# Altium project PCB_Project.PrjPcb
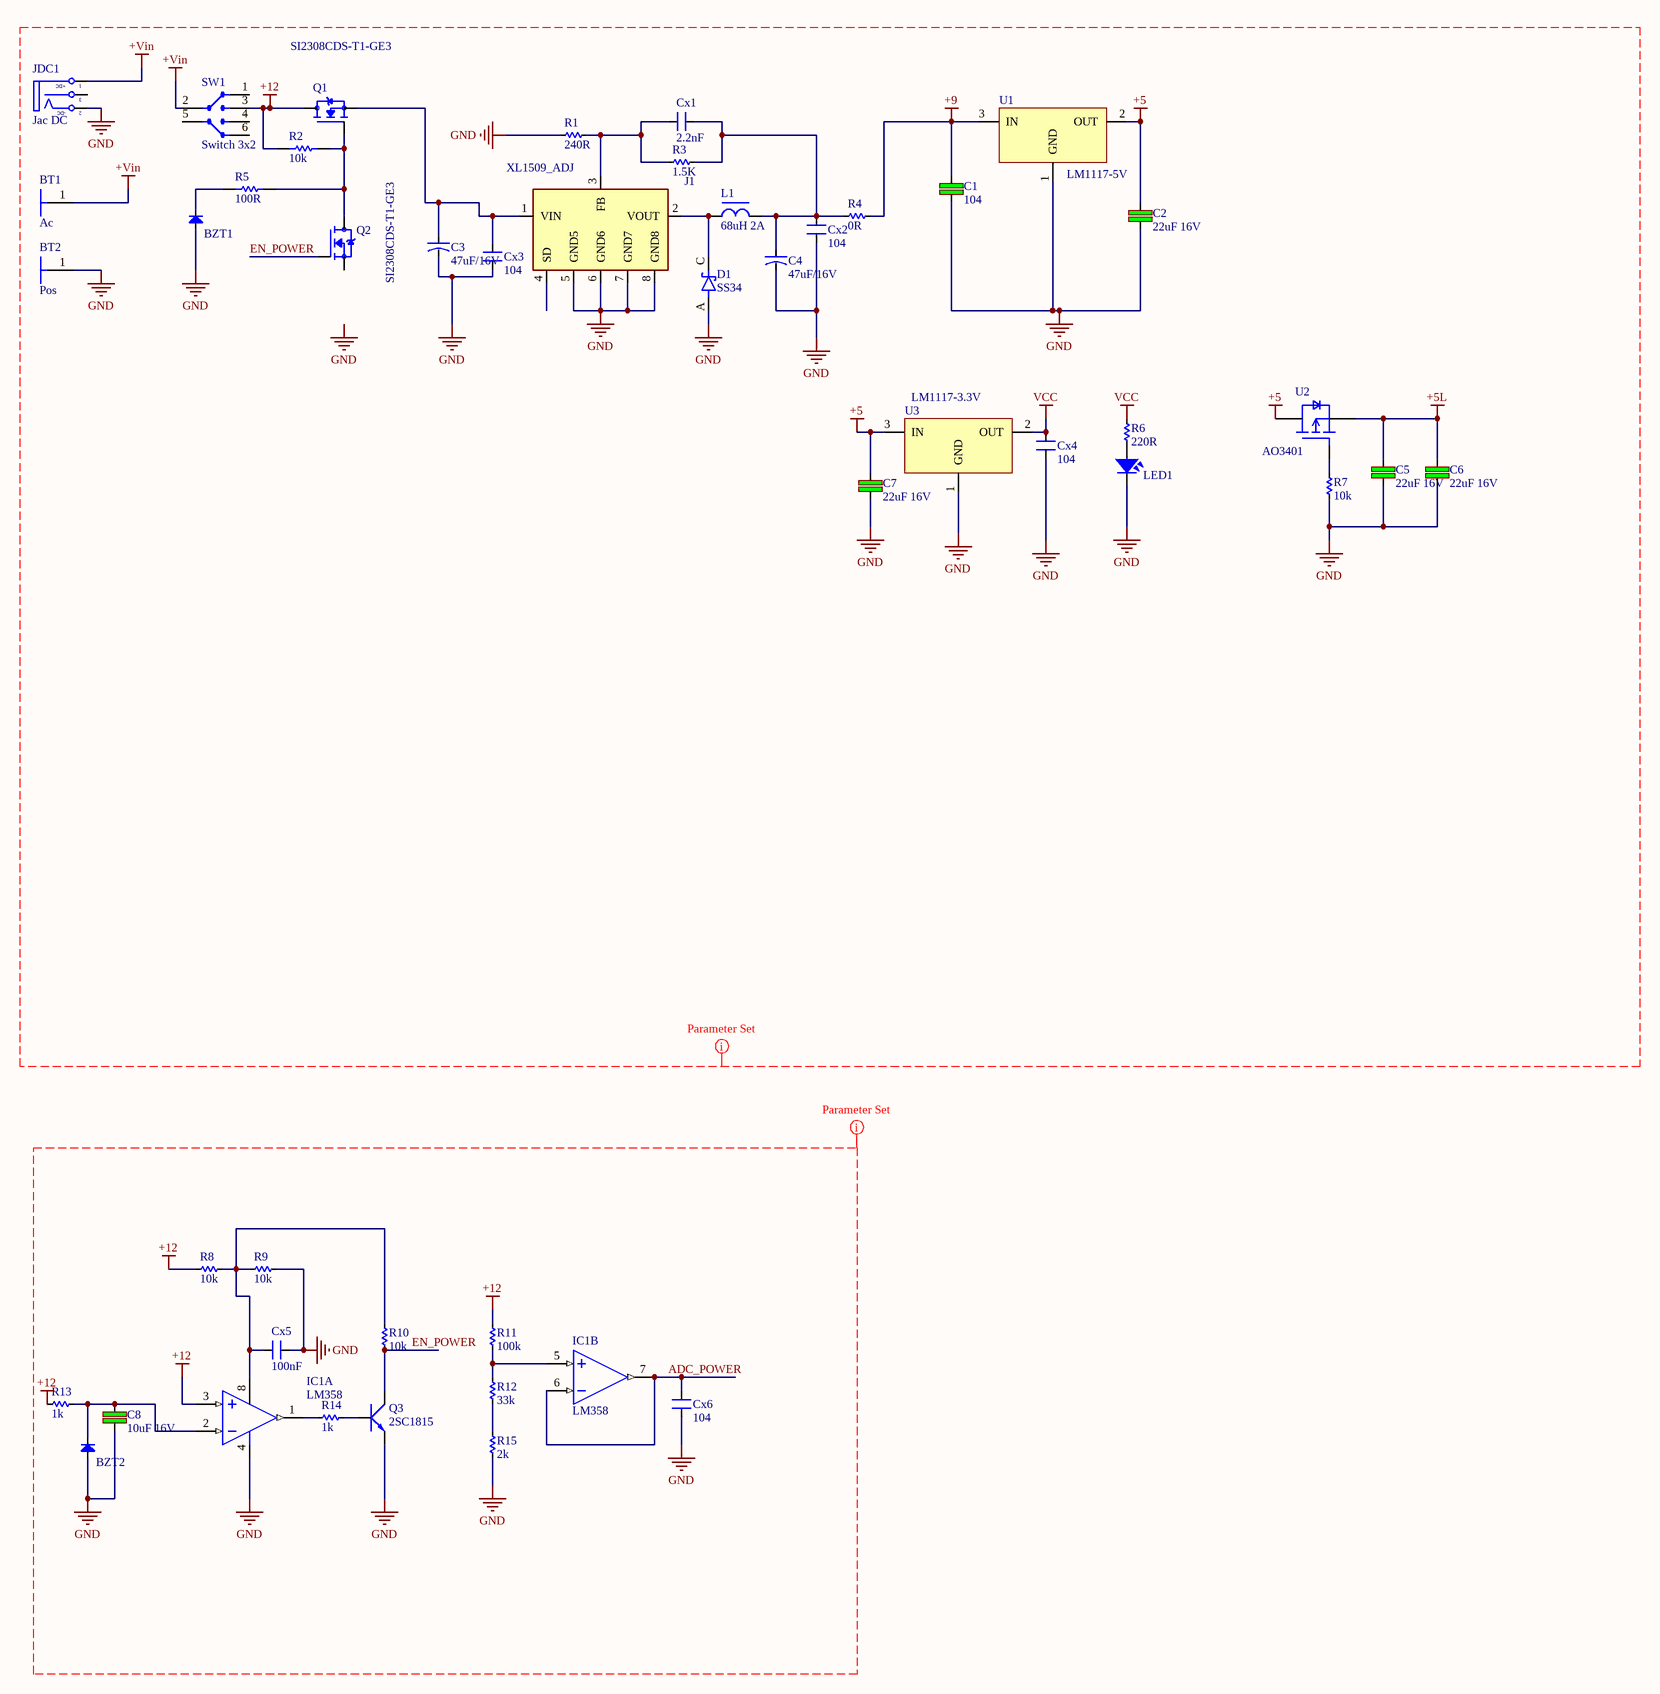
[diagram p0: Power.SchDoc]
4 sheets, 127 parts. Net scope: global (net labels, ports and power ports of the same name join across sheets).
Board file: MainPCB.PcbDoc
Sheets:
  Power.SchDoc
  MCU.SchDoc
  Motor.SchDoc
  LED.SchDoc

## Sheet Power.SchDoc
size C

### Parts
(Parts that share a designator on the sheet are numbered #1, #2 ... from top to bottom, then left to right.)
BT1  Ac  [BAT_BK-6223]
BT2  Pos  [BAT_BK-6223]
BZT1  Diode SMD  [DIO-SMD-123]  (value not drawn)
BZT2  Diode SMD  [DIO-SMD-123]  (value not drawn)
C1#1  104  [CN-SMD-0603]
C2#1  22uF 16V  [CN-SMD-1206]
C3#1  47uF/16V  [CAP-ALU-SMD-5.5x5.5]
C4#1  47uF/16V  [CAP-ALU-SMD-5.5x5.5]
C5#1  22uF 16V  [CN-SMD-1206]
C6#1  22uF 16V  [CN-SMD-1206]
C7#1  22uF 16V  [CN-SMD-1206]
C8  10uF 16V  [CN-SMD-1206]
Cx1#1  2.2nF  [CN-SMD-0603]
Cx2#1  104  [CN-SMD-0603]
Cx3#1  104  [CN-SMD-0603]
Cx4  104  [CN-SMD-0603]
Cx5  100nF  [CN-SMD-0603]
Cx6  104  [CN-SMD-0603]
D1  SS34  [DIOM5336X265N]
IC1  LM358  [SO8]  (parts A,B of 2)
J1#1  XL1509_ADJ  [SO08]
JDC1  Jac DC  [DC3]
L1  68uH 2A  [SMD Inductors CD54]
LED1#1  LED  [LED-0805-Blue]  (value not drawn)
Q1#1  SI2308CDS-T1-GE3  [SOT95P237X112-3N]
Q2#1  SI2308CDS-T1-GE3  [SOT95P237X112-3N]
Q3  2SC1815  [SOT23-321]
R1#1  240R  [RES-SMD-0603]
R2#1  value 10k  [RES-SMD-0603]  (hidden comment: 330)
R3#1  1.5K  [RES-SMD-0603]
R4#1  0R  [RES-SMD-0603]
R5#1  value 100R  [RES-SMD-0603]  (hidden comment: 330)
R6#1  220R  [RES-SMD-0603]
R7#1  10k  [RES-SMD-0603]
R8#1  10k  [RES-SMD-0603]
R9#1  10k  [RES-SMD-0603]
R10#1  10k  [RES-SMD-0603]
R11#1  100k  [RES-SMD-0603]
R12#1  33k  [RES-SMD-0603]
R13#1  1k  [RES-SMD-0603]
R14#1  1k  [RES-SMD-0603]
R15#1  2k  [RES-SMD-0603]
SW1#1  Switch 3x2  [SW3-DIP]
U1#1  LM1117-5V  [SOT223]
U2#1  AO3401  [SOT23-3]
U3#1  LM1117-3.3V  [SOT223]

### Nets
+5: C2#1.1 C7#1.1 U1#1.2(OUT) U2#1.3(D) U3#1.3(IN)
+5L: C5#1.1 C6#1.1 U2#1.2(S)
+9: C1#1.2 R4#1.2 U1#1.3(IN)
+12: IC1.3(IN+) Q1#1.3(D) R2#1.1 R8#1.1 R11#1.1 R13#1.2 SW1#1.3(I/O2)
+Vin: BT1.1 JDC1.1(T) SW1#1.2
GND: BT2.1 BZT1.1(A) BZT2.1(A) C1#1.1 C2#1.2 C3#1.2 C4#1.2 C5#1.2 C6#1.2 C7#1.2 C8.2 Cx2#1.1 Cx3#1.1 Cx4.1 Cx5.1 Cx6.1 D1.A IC1.4(-V) J1#1.5(GND5) J1#1.6(GND6) J1#1.7(GND7) J1#1.8(GND8) JDC1.2(TN) LED1#1.2 Q3.1(E) R1#1.1 R7#1.1 R9#1.2 R15#1.2 U1#1.1(GND) U3#1.1(GND)
VCC: Cx4.2 R6#1.2 U3#1.2(OUT)
ADC_POWER: Cx6.2 IC1.6(IN-) IC1.7(OUT)
EN_POWER: Q2#1.1(G) Q3.2(C) R10#1.1
NetBZT1_2: BZT1.2(K) R5#1.2
NetBZT2_2: BZT2.2(K) C8.1 IC1.2(IN-) R13#1.1
NetC3#1_1: C3#1.1 Cx3#1.2 J1#1.1(VIN) Q1#1.2(S)
NetC4#1_1: C4#1.1 Cx1#1.1 Cx2#1.2 L1.2 R3#1.2 R4#1.1
NetCx1#1_2: Cx1#1.2 J1#1.3(FB) R1#1.2 R3#1.1
NetCx5_2: Cx5.2 IC1.8(+V) R8#1.2 R9#1.1 R10#1.2
NetD1_C: D1.C(K) J1#1.2(VOUT) L1.1
NetIC1_1: IC1.1(OUT) R14#1.1
NetIC1_5: IC1.5(IN+) R11#1.2 R12#1.1
NetLED1#1_1: LED1#1.1 R6#1.1
NetQ1#1_1: Q1#1.1(G) Q2#1.3(D) R2#1.2 R5#1.1
NetQ3_3: Q3.3(B) R14#1.2
NetR7#1_2: R7#1.2 U2#1.1(G)
NetR12#1_2: R12#1.2 R15#1.1

Not connected (* = marked no-connect by the designer): J1#1 4(SD); JDC1 3(S); Q2#1 2(S); SW1#1 1 4 5(6) 6

### Layout directives
net class POWER: +5, +5L, +9, +12, +Vin, EN_POWER, GND, VCC
net class S_Power: +12, ADC_POWER, EN_POWER, GND

### Notes on the sheet
- Labels drawn without touching a wire or pin: GND
- (in symbol DCIN) +DC; -DC

### Library data of the parts
BT1 BT2 = BK-6223: AAAA Battery Contact; MF: MPD; Availability: Unavailable; Package: Non-Standard MPD; MP: BK-6223; Value: *; SnapEDA_Link: https://www.snapeda.com/parts/BK-6223/MPD/view-part/4614455/?ref=snap; Price: None
BZT1 BZT2 = Diode SMD: Default Diode; Code - JEDEC: DO-214-AB; Value: 1N5007; Published: 8-Jun-2000; Revision: July-2002: Re-released for DXP Platform.; Publisher: Altium Limited
C1#1 = C: Cap SMD; Value: 103
C2#1 C5#1 C6#1 C7#1 C8 = C: Cap SMD 1206 >5V; Value: 103
C3#1 C4#1 = CN-ALU-SMD: Polarized Capacitor (Axial); Published: 8-Jun-2000; LatestRevisionDate: 17-Jul-2002; LatestRevisionNote: Re-released for DXP Platform.; PackageReference: POLAR0.8; Publisher: Altium Limited
Cx1#1 Cx2#1 Cx3#1 Cx4-Cx6 = CN: Value: 33pF
D1 = SS24: 1; MF: TE Connectivity / Alcoswitch; Mouser-Purchase-URL: https://snapeda.com/shop?store=Mouser&id=1080652; SnapEDA_Link: https://www.snapeda.com/parts/SS24/TE%20Connectivity%20/%20Alcoswitch/view-part/1080652/?ref=snap; Package: DO-214AA-214 TE Connectivity / Alcoswitch; MP: SS24; Value: *; Arrow_Electronics-Purchase-URL: https://snapeda.com/shop?store=Arrow+Electronics&id=1080652
IC1 = LM358: Low-Power Dual Operational Amplifier; Value: LM358
J1#1 = AP1509-50SG-13: Buck Switching Regulator IC Positive Fixed 5V 1 Output 2A 8-SOIC (0.154, 3.90mm Width); MF: Diodes Inc.; SnapEDA_Link: https://www.snapeda.com/parts/AP1509-50SG-13/Diodes%20Inc./view-part/1039892/?ref=snap; MP: AP1509-50SG-13; Availability: Good; Price: None; Package: SOP-8 Diodes Inc.; Value: *; Check_prices: https://www.snapeda.com/parts/AP1509-50SG-13/Diodes%20Inc./view-part/1039892/?ref=eda; Purchase-URL: https://pricing.snapeda.com/search/part/AP1509-50SG-13/?ref=eda
JDC1 = DCIN: Jac DC input; Value: Jac DC
L1 = L-DIP-1: Inductor; Value: 150 mH
LED1#1 = LED SMD: Value: LED 3 - 5 ly 2 Colour
Q1#1 Q2#1 = SI2308CDS-T1-GE3: N-Channel 60V 2.6A (Tc) 1.6W (Tc) Surface Mount SOT-23-3 (TO-236); MF: Vishay Siliconix; Package: SOT-23-3 Vishay Siliconix; MP: SI2308CDS-T1-GE3; Value: *; SnapEDA_Link: https://www.snapeda.com/parts/SI2308CDS-T1-GE3/Vishay%20Siliconix/view-part/2523766/?ref=snap; Availability: Unavailable; Price: None
Q3 = 2SC1815: NPN 600mW, ECB; Value: C1815
R1#1 R3#1 R4#1 R6#1 R7#1 R8#1 R9#1 R10#1 R11#1 R12#1 R13#1 R14#1 R15#1 = Res-SMD: Resistor; Manufacturer: Generic Components; Class: Passive; Published: 08/06/2000; Publisher: Altium Hobart Technology Centre
R2#1 R5#1 = RESISTOR SMD: 330R
SW1#1 = SW3x2: Value: Switch 4x2
U1#1 U3#1 = LM1117: 800mA Low-Dropout Linear Regulator; Creator: Nguyen Ba Bien; Website: http://group3i.net
U2#1 = AO3401: P-Channel 30V 4A (Ta) 1.4W (Ta) Surface Mount SOT-23-3L; MF: Alpha & Omega Semiconductor; Price: None; SnapEDA_Link: https://www.snapeda.com/parts/AO3401/Alpha%20&%20Omega%20Semiconductor/view-part/4795619/?ref=snap; Arrow_Electronics-Purchase-URL: https://snapeda.com/shop?store=Arrow+Electronics&id=4795619; Availability: Warning; MP: AO3401; Value: *; Package: SOT-23-3 Alpha &amp; Omega Semiconductor

## Sheet MCU.SchDoc
size D
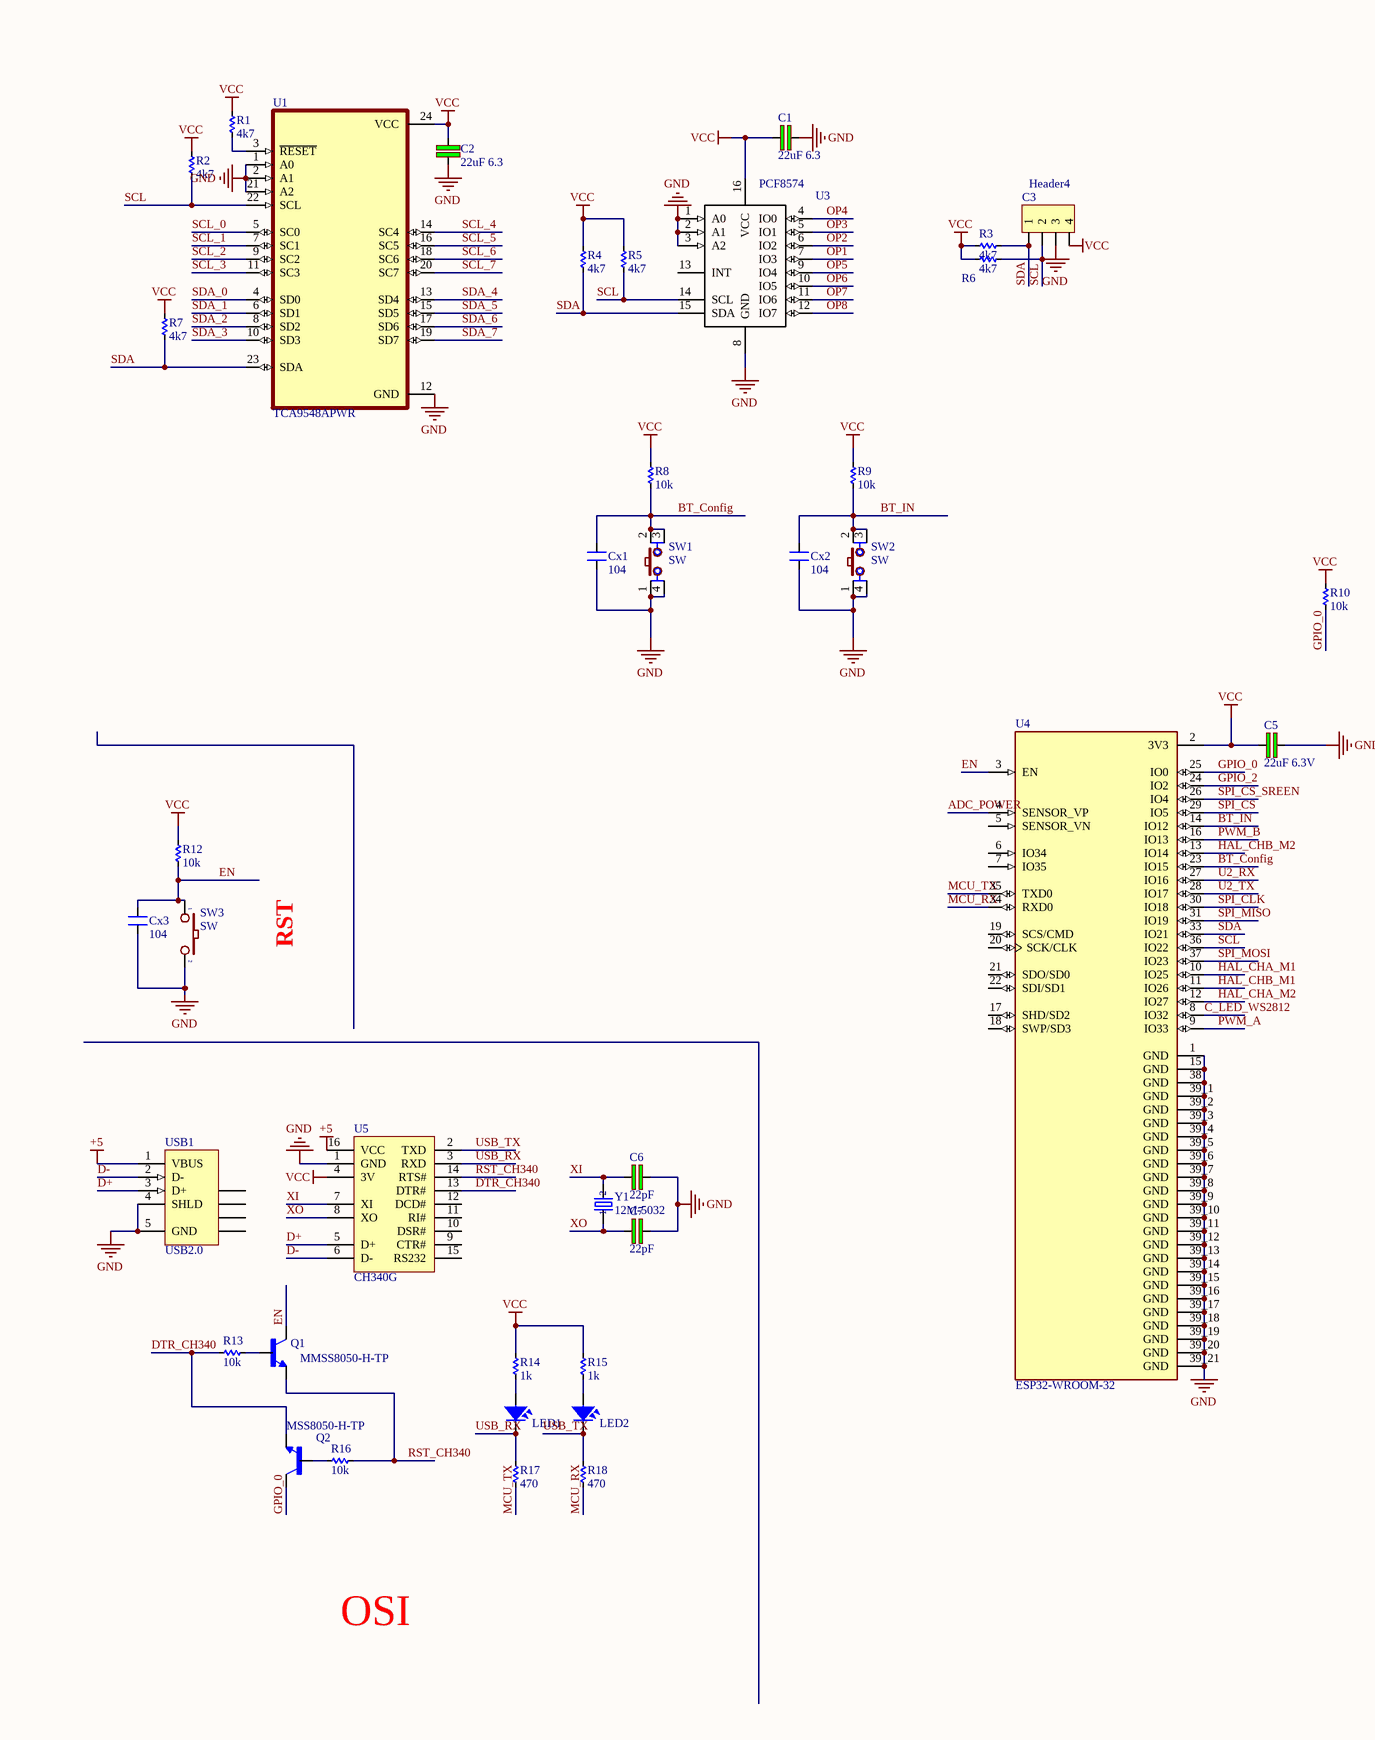
[diagram p1: MCU.SchDoc, left]
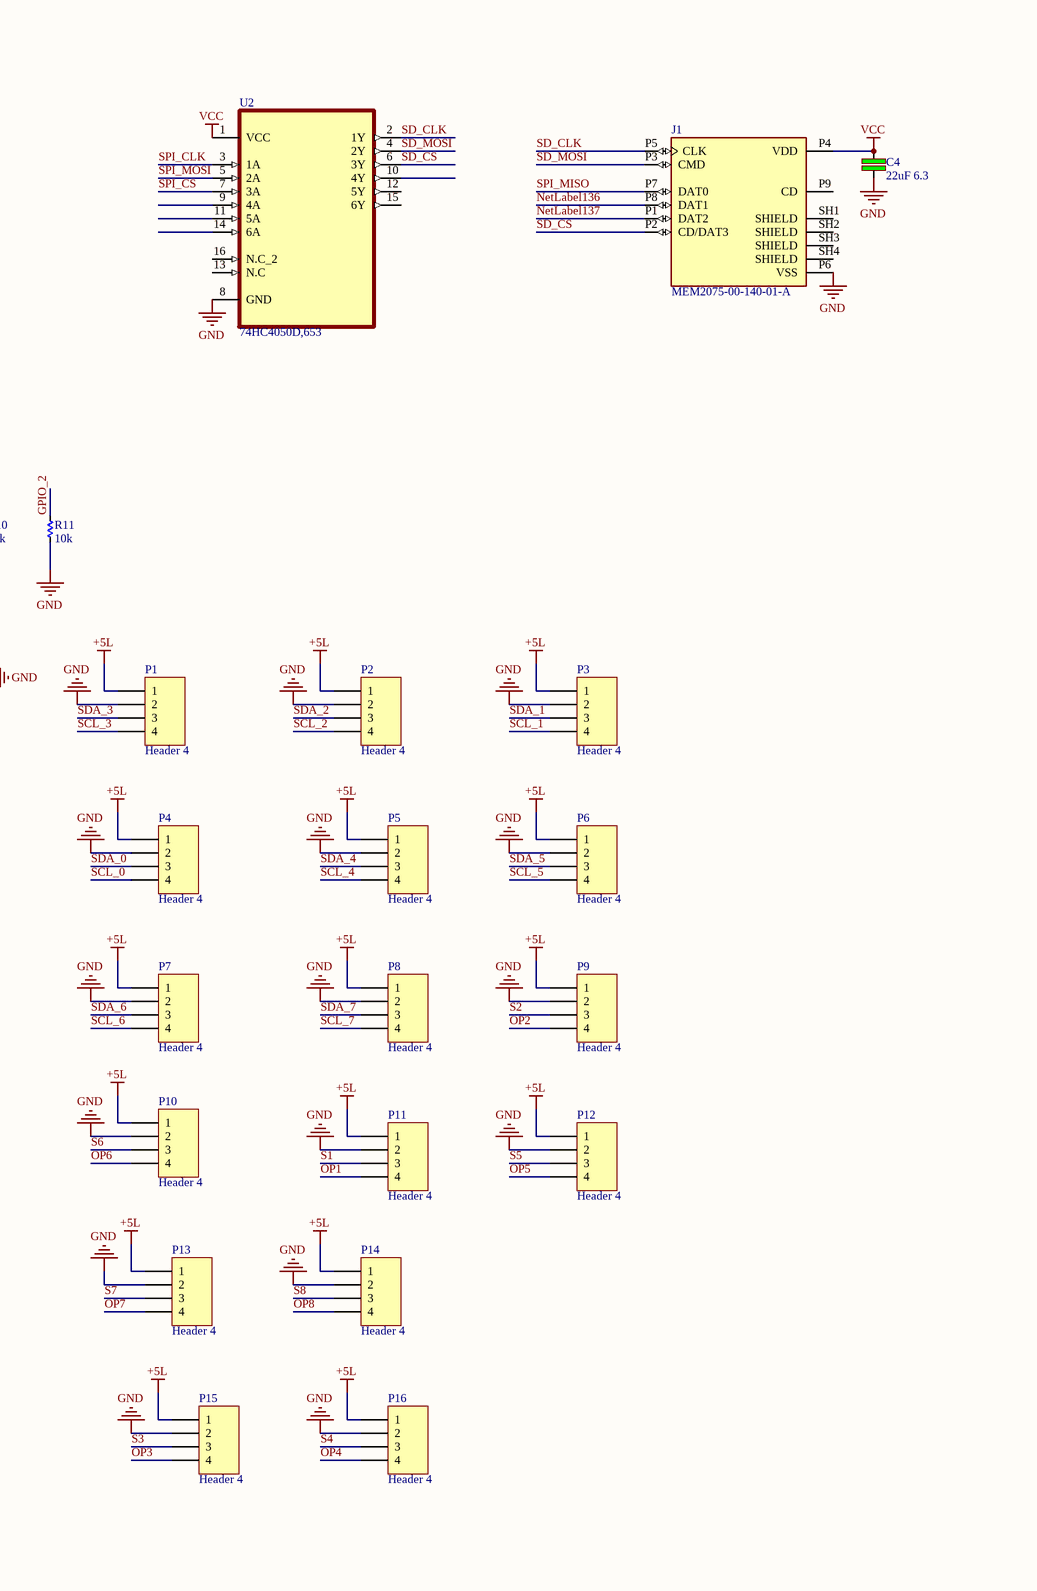
[diagram p2: MCU.SchDoc, right]

### Parts
(Parts that share a designator on the sheet are numbered #1, #2 ... from top to bottom, then left to right.)
C1#2  22uF 6.3  [CN-SMD-1206]
C2#2  22uF 6.3  [CN-SMD-1206]
C3#2  Header4  [JP4-C1T]
C4#2  22uF 6.3  [CN-SMD-1206]
C5#2  22uF 6.3V  [CN-SMD-1206]
C6#2  22pF  [CN-SMD-0603]
C7#2  22pF  [CN-SMD-0603]
Cx1#2  104  [CN-SMD-0603]
Cx2#2  104  [CN-SMD-0603]
Cx3#2  104  [CN-SMD-0603]
J1#2  MEM2075-00-140-01-A  [GCT_MEM2075-00-140-01-A]
LED1#2  LED  [LED-0805-Blue]  (value not drawn)
LED2  LED  [LED-0805-Blue]  (value not drawn)
P1  Header 4  [Header_4_ngang]
P2  Header 4  [Header_4_ngang]
P3  Header 4  [Header_4_ngang]
P4  Header 4  [Header_4_ngang]
P5  Header 4  [Header_4_ngang]
P6  Header 4  [Header_4_ngang]
P7  Header 4  [Header_4_ngang]
P8  Header 4  [Header_4_ngang]
P9  Header 4  [Header_4_ngang]
P10  Header 4  [Header_4_ngang]
P11  Header 4  [Header_4_ngang]
P12  Header 4  [Header_4_ngang]
P13  Header 4  [Header_4_ngang]
P14  Header 4  [Header_4_ngang]
P15  Header 4  [Header_4_ngang]
P16  Header 4  [Header_4_ngang]
Q1#2  MMSS8050-H-TP  [TRANS_MMSS8050-H-TP]
Q2#2  MSS8050-H-TP  [TRANS_MMSS8050-H-TP]
R1#2  4k7  [RES-SMD-0603]
R2#2  4k7  [RES-SMD-0603]
R3#2  4k7  [RES-SMD-0603]
R4#2  4k7  [RES-SMD-0603]
R5#2  4k7  [RES-SMD-0603]
R6#2  4k7  [RES-SMD-0603]
R7#2  4k7  [RES-SMD-0603]
R8#2  10k  [RES-SMD-0603]
R9#2  10k  [RES-SMD-0603]
R10#2  10k  [RES-SMD-0603]
R11#2  10k  [RES-SMD-0603]
R12#2  10k  [RES-SMD-0603]
R13#2  10k  [RES-SMD-0603]
R14#2  1k  [RES-SMD-0603]
R15#2  1k  [RES-SMD-0603]
R16  10k  [RES-SMD-0603]
R17  470  [RES-SMD-0603]
R18  470  [RES-SMD-0603]
SW1#2  SW  [SW2-SMD]
SW2  SW  [SW2-SMD]
SW3  SW  [SW1-SMD]
U1#2  TCA9548APWR  [SOP65P640X120-24N]
U2#2  74HC4050D,653  [SOIC127P600X175-16N]
U3#2  PCF8574  [SO16L]
U4  ESP32-WROOM-32  [MODULE_ESP32-WROOM-32]
U5  CH340G  [SO16]
USB1  USB2.0  [USB mini]
Y1  12M-5032  [X2-SMD-5.0X3.2X1.3MM]

### Nets
+5: U5.16(VCC) USB1.1(VBUS)
+5L: P1.1 P2.1 P3.1 P4.1 P5.1 P6.1 P7.1 P8.1 P9.1 P10.1 P11.1 P12.1 P13.1 P14.1 P15.1 P16.1
GND: C1#2.1 C2#2.1 C3#2.3 C4#2.1 C5#2.1 C6#2.2 C7#2.2 Cx1#2.1 Cx2#2.1 Cx3#2.1 J1#2.P6(VSS) P1.2 P2.2 P3.2 P4.2 P5.2 P6.2 P7.2 P8.2 P9.2 P10.2 P11.2 P12.2 P13.2 P14.2 P15.2 P16.2 R11#2.1 SW1#2.1 SW1#2.4 SW2.1 SW2.4 SW3.2 U1#2.1(A0) U1#2.2(A1) U1#2.12(GND) U1#2.21(A2) U2#2.8(GND) U3#2.1(A0) U3#2.2(A1) U3#2.3(A2) U3#2.8(GND) U4.1(GND) U4.15(GND) U4.38(GND) U4.39_1(GND) U4.39_2(GND) U4.39_3(GND) U4.39_4(GND) U4.39_5(GND) U4.39_6(GND) U4.39_7(GND) U4.39_8(GND) U4.39_9(GND) U4.39_10(GND) U4.39_11(GND) U4.39_12(GND) U4.39_13(GND) U4.39_14(GND) U4.39_15(GND) U4.39_16(GND) U4.39_17(GND) U4.39_18(GND) U4.39_19(GND) U4.39_20(GND) U4.39_21(GND) U5.1(GND) USB1.4(SHLD) USB1.5(GND)
VCC: C1#2.2 C2#2.2 C3#2.4 C4#2.2 C5#2.2 J1#2.P4(VDD) R1#2.2 R2#2.2 R3#2.2 R4#2.2 R5#2.2 R6#2.2 R7#2.2 R8#2.2 R9#2.2 R10#2.2 R12#2.2 R14#2.2 R15#2.2 U1#2.24(VCC) U2#2.1(VCC) U3#2.16(VCC) U4.2(3V3) U5.4(3V)
ADC_POWER: U4.4(SENSOR_VP)
BT_Config: Cx1#2.2 R8#2.1 SW1#2.2 SW1#2.3 U4.23(IO15)
BT_IN: Cx2#2.2 R9#2.1 SW2.2 SW2.3 U4.14(IO12)
C_LED_WS2812: U4.8(IO32)
D+: U5.5(D+) USB1.3(D+)
D-: U5.6(D-) USB1.2(D-)
DTR_CH340: Q2#2.2(E) R13#2.1 U5.13(DTR#)
EN: Cx3#2.2 Q1#2.3(C) R12#2.1 SW3.1 U4.3(EN)
GPIO_0: Q2#2.3(C) R10#2.1 U4.25(IO0)
GPIO_2: R11#2.2 U4.24(IO2)
HAL_CHA_M1: U4.10(IO25)
HAL_CHA_M2: U4.12(IO27)
HAL_CHB_M1: U4.11(IO26)
HAL_CHB_M2: U4.13(IO14)
MCU_RX: R18.1 U4.34(RXD0)
MCU_TX: R17.1 U4.35(TXD0)
NetLabel136: J1#2.P8(DAT1)
NetLabel137: J1#2.P1(DAT2)
OP1: P11.4 U3#2.7(IO3)
OP2: P9.4 U3#2.6(IO2)
OP3: P15.4 U3#2.5(IO1)
OP4: P16.4 U3#2.4(IO0)
OP5: P12.4 U3#2.9(IO4)
OP6: P10.4 U3#2.10(IO5)
OP7: P13.4 U3#2.11(IO6)
OP8: P14.4 U3#2.12(IO7)
PWM_A: U4.9(IO33)
PWM_B: U4.16(IO13)
RST_CH340: Q1#2.2(E) R16.2 U5.14(RTS#)
S1: P11.3
S2: P9.3
S3: P15.3
S4: P16.3
S5: P12.3
S6: P10.3
S7: P13.3
S8: P14.3
SCL: C3#2.2 R2#2.1 R5#2.1 R6#2.1 U1#2.22(SCL) U3#2.14(SCL) U4.36(IO22)
SCL_0: P4.4 U1#2.5(SC0)
SCL_1: P3.4 U1#2.7(SC1)
SCL_2: P2.4 U1#2.9(SC2)
SCL_3: P1.4 U1#2.11(SC3)
SCL_4: P5.4 U1#2.14(SC4)
SCL_5: P6.4 U1#2.16(SC5)
SCL_6: P7.4 U1#2.18(SC6)
SCL_7: P8.4 U1#2.20(SC7)
SD_CLK: J1#2.P5(CLK) U2#2.2(1Y)
SD_CS: J1#2.P2(CD/DAT3) U2#2.6(3Y)
SD_MOSI: J1#2.P3(CMD) U2#2.4(2Y)
SDA: C3#2.1 R3#2.1 R4#2.1 R7#2.1 U1#2.23(SDA) U3#2.15(SDA) U4.33(IO21)
SDA_0: P4.3 U1#2.4(SD0)
SDA_1: P3.3 U1#2.6(SD1)
SDA_2: P2.3 U1#2.8(SD2)
SDA_3: P1.3 U1#2.10(SD3)
SDA_4: P5.3 U1#2.13(SD4)
SDA_5: P6.3 U1#2.15(SD5)
SDA_6: P7.3 U1#2.17(SD6)
SDA_7: P8.3 U1#2.19(SD7)
SPI_CLK: U2#2.3(1A) U4.30(IO18)
SPI_CS: U2#2.7(3A) U4.29(IO5)
SPI_CS_SREEN: U4.26(IO4)
SPI_MISO: J1#2.P7(DAT0) U4.31(IO19)
SPI_MOSI: U2#2.5(2A) U4.37(IO23)
U2_RX: U4.27(IO16)
U2_TX: U4.28(IO17)
USB_RX: LED1#2.2 R17.2 U5.3(RXD)
USB_TX: LED2.2 R18.2 U5.2(TXD)
XI: C6#2.1 U5.7(XI) Y1.2
XO: C7#2.1 U5.8(XO) Y1.1
NetLED1#2_1: LED1#2.1 R14#2.1
NetLED2_1: LED2.1 R15#2.1
NetQ1#2_1: Q1#2.1(B) R13#2.2
NetQ2#2_1: Q2#2.1(B) R16.1
NetR1#2_1: R1#2.1 U1#2.3(~{RESET})

Not connected (* = marked no-connect by the designer): J1#2 P9(CD) SH1(SHIELD) SH2(SHIELD) SH3(SHIELD) SH4(SHIELD); U2#2 9(4A) 10(4Y) 11(5A) 12(5Y) 13(N.C) 14(6A) 15(6Y) 16(N.C_2); U3#2 13(INT); U4 5(SENSOR_VN) 6(IO34) 7(IO35) 17(SHD/SD2) 18(SWP/SD3) 19(SCS/CMD) 20(SCK/CLK) 21(SDO/SD0) 22(SDI/SD1); U5 9(CTR#) 10(DSR#) 11(RI#) 12(DCD#) 15(RS232); USB1 6(SHLD) 7(SHLD) 8(SHLD) 9(SHLD)

### Layout directives
net class MCU: +5, +5L, ADC_POWER, BT_Config, BT_IN, C_LED_WS2812, D+, D-, DTR_CH340, EN, GND, GPIO_0, GPIO_2, HAL_CHA_M1, HAL_CHA_M2, HAL_CHB_M1, HAL_CHB_M2, MCU_RX, MCU_TX, NetLabel136, NetLabel137, OP1, OP2, OP3, OP4, OP5, OP6, OP7, OP8, PWM_A, PWM_B, RST_CH340, S1, S2, S3, S4, S5, S6, S7, S8, SCL, SCL_0, SCL_1, SCL_2, SCL_3, SCL_4, SCL_5, SCL_6, SCL_7, SD_CLK, SD_CS, SD_MOSI, SDA, SDA_0, SDA_1, SDA_2, SDA_3, SDA_4, SDA_5, SDA_6, SDA_7, SPI_CLK, SPI_CS, SPI_CS_SREEN, SPI_MISO, SPI_MOSI, U2_RX, U2_TX, USB_RX, USB_TX, VCC, XI, XO

### Notes on the sheet
- RST
- OSI

### Library data of the parts
C1#2 C2#2 C4#2 C5#2 = C: Cap SMD 1206 >5V; Value: 103
C3#2 = Header4: Header IDC, 4 x 1 Pin Vertical 2.54mm Pitch (Non-Boxed, Male); Manufacturer: W¨¹rth Elektronik eiSos GmbH; partNo: 613002143121; ComponentLink1 Description: Manufacturer; ComponentLink2 Description: Datasheet; NoPins: 02; Created Date: 29 March 2013; ComponentLink1URL: http://www.we-online.com; ComponentLink2URL: http://katalog.we-online.de/em/datasheet/6130xx143121.pdf; Created by: Karrer Zheng
C6#2 C7#2 = C: Cap SMD; Value: 103
Cx1#2 Cx2#2 Cx3#2 = CN: Value: 33pF
J1#2 = MEM2075-00-140-01-A: 9 _8 + 1_ Position Card Connector microSDâ„¢ Surface Mount, Right Angle Gold; MF: Global Connector Technology; Availability: Unavailable; Price: None; SnapEDA_Link: https://www.snapeda.com/parts/MEM2075-00-140-01-A/Global%20Connector%20Technology/view-part/2680480/?ref=snap; Value: *; Package: Package Analog Devices; MP: MEM2075-00-140-01-A
LED1#2 LED2 = LED SMD: Value: LED 3 - 5 ly 2 Colour
P1-P16 = Header 4: Header, 4-Pin; LatestRevisionDate: 17-Jul-2002; LatestRevisionNote: Re-released for DXP Platform.; Publisher: Altium Limited
Q1#2 Q2#2 = MMSS8050-H-TP: Bipolar _BJT_ Transistor NPN 25V 1.5A 100MHz 625mW Surface Mount SOT-23; MF: Micro Commercial; Value: *; Availability: Unavailable; SnapEDA_Link: https://www.snapeda.com/parts/MMSS8050-H-TP/Micro%20Commercial/view-part/423878/?ref=snap; Package: SOT-23 Micro Commercial; MP: MMSS8050-H-TP; Price: None
R1#2 R2#2 R3#2 R4#2 R5#2 R6#2 R7#2 R8#2 R9#2 R10#2 R11#2 R12#2 R13#2 R14#2 R15#2 R16-R18 = Res-SMD: as R1#1 on sheet Power; Published: 08/06/2000; Publisher: Altium Hobart Technology Centre
SW1#2 SW2 = SW4: Switch button 4 pin; Value: Button chip 4 pin
SW3 = SW2: Switch button 2 pin; Value: SW chip 2 pin
U1#2 = TCA9548APWR: Low-Voltage 8-Channel I2C Switch With Reset; MF: Texas Instruments; MP: TCA9548APWR; Price: None; DigiKey-Purchase-URL: https://snapeda.com/shop?store=DigiKey&id=280817; Package: TSSOP-24 Texas Instruments; Mouser-Purchase-URL: https://snapeda.com/shop?store=Mouser&id=280817; Texas_Instruments-Purchase-URL: https://snapeda.com/shop?store=Texas+Instruments&id=280817; Value: *; Availability: Unavailable; Arrow_Electronics-Purchase-URL: https://snapeda.com/shop?store=Arrow+Electronics&id=280817; SnapEDA_Link: https://www.snapeda.com/parts/TCA9548APWR/Texas%20Instruments/view-part/280817/?ref=snap
U2#2 = 74HC4050D,653: Buffer, Non-Inverting 6 Element 1 Bit per Element Push-Pull Output 16-SO; MF: Nexperia USA; Value: *; SnapEDA_Link: https://www.snapeda.com/parts/74HC4050D%2C653/Nexperia%20USA%20Inc./view-part/1791461/?ref=snap; Digi-Key_Purchase_URL: https://www.digikey.com/product-detail/en/nexperia-usa-inc/74HC4050D,653/1727-6331-1-ND/2762840?utm_source=snapeda&utm_medium=aggregator&utm_campaign=symbol; Package: SO-16 Nexperia; Digi-Key_Part_Number: 1727-6331-1-ND; MP: 74HC4050D,653
U3#2 = PCF8574: I2C PORT EXPANDER; Manufacturer Part Number: PCF8574T/3,512; Manufacturer: NXP Semiconductors; Includes: POR; Interface: I²C; Interrupt Output: Yes; Number of I /O: 8; Voltage - Supply: 2.5 V ~ 6 V; Frequency - Clock: 100KHz; Supplier 1: Digi-Key; Supplier Part Number 1: 568-1076-5-ND; Package / Case: 16-SOIC (7.5mm Width); Category: Integrated Circuits (ICs); Supplier Part Number: 568-1076-5-ND; Operating Temperature: -40°C ~ 85°C; Packaging: Tube; RoHS: RoHS Compliant; Supplier: Digi-Key
U4 = ESP32-WROOM-32: Bluetooth, WiFi Transceiver Module 2.4GHz ~ 2.5GHz Surface Mount; MF: Espressif Systems; Package: Module Espressif Systems; Digi-Key_Part_Number: 1904-1010-1-ND; Digi-Key_Purchase_URL: https://www.digikey.com/product-detail/en/espressif-systems/ESP32-WROOM-32/1904-1010-1-ND/8544305?utm_source=snapeda&utm_medium=aggregator&utm_campaign=symbol; Value: *; MP: ESP32-WROOM-32; SnapEDA_Link: https://www.snapeda.com/parts/ESP32-WROOM-32/Espressif%20Systems/view-part/2753322/?ref=snap
U5 = CH340G: High and Low Side Driver; Note: Pins 4, 8 and 14 are not connected; Published: 8-Jun-2000; LatestRevisionDate: 04-Mar-2005; LatestRevisionNote: Stylized 3D Model Added.; DatasheetVersion: PD60147J; PackageReference: PDIP14; Publisher: Altium Limited; PackageDescription: DIP; 14 Leads; Row Spacing 7.62 mm; Pitch 2.54 mm; ComponentLink1Description: Manufacturer Link; ComponentLink1URL: http://www.irf.com/; ComponentLink2Description: Datasheet; ComponentLink2URL: http://www.irf.com/product-info/datasheets/data/ir2110.pdf
USB1 = USB: USB 2.0, Right Angle, SMT, B Type, Receptacle, 5 Position, Black; ContactMaterial: Copper Alloy; ContactPlating: Gold (30); PCB_Layout: Complies with manufacturer's recommendation.; DrillSize: Corresponds to nominal value.; PanelGround: Without; Published: 15-Jul-2004; DatasheetDocument: 27-Jun-2003; PackageDocument: 27-Jun-2003; PackageReference: 440247; Publisher: Altium Limited; HousingMaterial: Thermoplastic; ComponentLink1Description: Manufacturer Link; ComponentLink1URL: http://www.tycoelectronics.com/; ComponentLink2Description: Packaging Specification; ComponentLink2URL: http://ecommas.tycoelectronics.com/commerce/DocumentDelivery/DDEController?Action=showdoc&DocId=Customer+Drawing%7F440247%7FD%7Fpdf%7FEnglish%7FC_440247_D.pdf
Y1 = SMD-CRYSTAL-8MHZ-20PF-20PPM(2P-5.0X3.2MM): SMD Crystal 8MHz-20pF-20ppm;; MF: Xinhunjing; MP: 5032/4P; Price: None; Availability: Unavailable; Package: None; SnapEDA_Link: https://www.snapeda.com/parts/5032/4P/Xinhunjing/view-part/105660/?ref=snap; Value: *

## Sheet Motor.SchDoc
size A
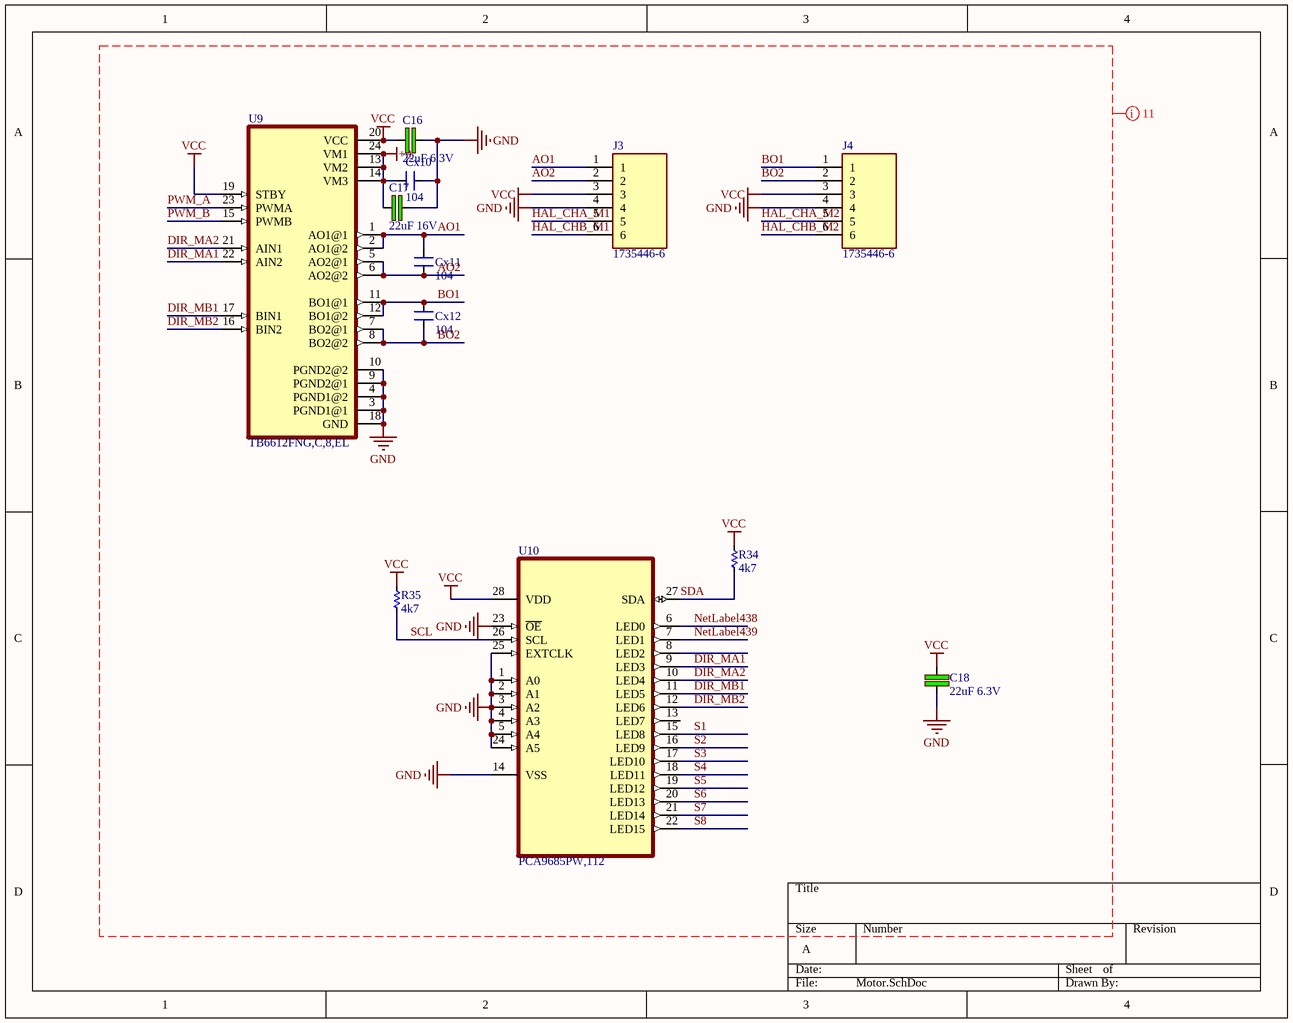
[diagram p3: Motor.SchDoc]

### Parts
C16  22uF 6.3V  [CN-SMD-1206]
C17  22uF 16V  [CN-SMD-1206]
C18  22uF 6.3V  [CN-SMD-1206]
Cx10  104  [CN-SMD-0603]
Cx11  104  [CN-SMD-0603]
Cx12  104  [CN-SMD-0603]
J3  1735446-6  [TE_1735446-6]
J4  1735446-6  [TE_1735446-6]
R34  4k7  [RES-SMD-0603]
R35  4k7  [RES-SMD-0603]
U9  TB6612FNG,C,8,EL  [SOP65P760X160-24N]
U10  PCA9685PW,112  [SOP65P640X110-28N]

### Nets
+9: C17.1 Cx10.2 U9.13(VM2) U9.14(VM3) U9.24(VM1)
GND: C16.1 C17.2 C18.1 Cx10.1 J3.4 J4.4 U9.3(PGND1@1) U9.4(PGND1@2) U9.9(PGND2@1) U9.10(PGND2@2) U9.18(GND) U10.1(A0) U10.2(A1) U10.3(A2) U10.4(A3) U10.5(A4) U10.14(VSS) U10.23(~{OE}) U10.24(A5) U10.25(EXTCLK)
VCC: C16.2 C18.2 J3.3 J4.3 R34.2 R35.2 U9.19(STBY) U9.20(VCC) U10.28(VDD)
AO1: Cx11.1 J3.1 U9.1(AO1@1) U9.2(AO1@2)
AO2: Cx11.2 J3.2 U9.5(AO2@1) U9.6(AO2@2)
BO1: Cx12.1 J4.1 U9.11(BO1@1) U9.12(BO1@2)
BO2: Cx12.2 J4.2 U9.7(BO2@1) U9.8(BO2@2)
DIR_MA1: U9.22(AIN2) U10.9(LED3)
DIR_MA2: U9.21(AIN1) U10.10(LED4)
DIR_MB1: U9.17(BIN1) U10.11(LED5)
DIR_MB2: U9.16(BIN2) U10.12(LED6)
HAL_CHA_M1: J3.5
HAL_CHA_M2: J4.5
HAL_CHB_M1: J3.6
HAL_CHB_M2: J4.6
NetLabel438: U10.6(LED0)
NetLabel439: U10.7(LED1)
PWM_A: U9.23(PWMA)
PWM_B: U9.15(PWMB)
S1: U10.15(LED8)
S2: U10.16(LED9)
S3: U10.17(LED10)
S4: U10.18(LED11)
S5: U10.19(LED12)
S6: U10.20(LED13)
S7: U10.21(LED14)
S8: U10.22(LED15)
SCL: R35.1 U10.26(SCL)
SDA: R34.1 U10.27(SDA)

Not connected (* = marked no-connect by the designer): U10 8(LED2) 13(LED7)

### Layout directives
net class Motor: +9, AO1, AO2, BO1, BO2, DIR_MA1, DIR_MA2, DIR_MB1, DIR_MB2, GND, HAL_CHA_M1, HAL_CHA_M2, HAL_CHB_M1, HAL_CHB_M2, NetLabel438, NetLabel439, PWM_A, PWM_B, S1, S2, S3, S4, S5, S6, S7, S8, SCL, SDA, VCC

### Library data of the parts
C16-C18 = C: Cap SMD 1206 >5V; Value: 103
Cx10-Cx12 = CN: Value: 33pF
J3 J4 = 1735446-6: 2MM PITCH HPI POST HEADER, VERTICAL, 6P; Centerline_Pitch: 2 mm[.079 in]; Number_of_Positions: 6; MF: TE Connectivity; Product_Type: Connector; Availability: Unavailable; EU_RoHS_Compliance: Compliant; SnapEDA_Link: https://www.snapeda.com/parts/1735446-6/TE%20Connectivity%20AMP%20Connectors/view-part/492311/?ref=snap; Price: None; Package: None; MP: 1735446-6; TE_purchase_URL: https://www.te.com/usa-en/product-1735446-6.html?te_bu=Cor&te_type=disp&te_campaign=seda_glo_cor-seda-global-disp-prtnr-fy19-seda-model-bom-cta_sma-317_1&elqCampaignId=32493; Value: *
R34 R35 = Res-SMD: as R1#1 on sheet Power; Published: 08/06/2000; Publisher: Altium Hobart Technology Centre
U9 = TB6612FNG,C,8,EL: Motor Driver Power MOSFET Parallel 24-SSOP; MF: Toshiba; Digi-Key_Part_Number: TB6612FNGC8ELCT-ND; MP: TB6612FNG,C,8,EL; Value: *; SnapEDA_Link: https://www.snapeda.com/parts/TB6612FNG%2CC%2C8%2CEL/Toshiba%20Semiconductor%20and%20Storage/view-part/424445/?ref=snap; Digi-Key_Purchase_URL: https://www.digikey.com/product-detail/en/toshiba-semiconductor-and-storage/TB6612FNG,C,8,EL/TB6612FNGC8ELCT-ND/1730134?utm_source=snapeda&utm_medium=aggregator&utm_campaign=symbol; Package: SSOP-24 Toshiba
U10 = PCA9685PW,112: LED Driver IC 16 Output Linear PWM Dimming 25mA 28-TSSOP; MF: NXP USA; Purchase-URL: https://pricing.snapeda.com/search/part/PCA9685PW,112/?ref=eda; Value: *; Package: TSSOP-28 NXP Semiconductors; Digi-Key_Part_Number: 568-8366-5-ND; SnapEDA_Link: https://www.snapeda.com/parts/PCA9685PW,112/NXP%20USA%20Inc./view-part/550390/?ref=snap; MP: PCA9685PW,112; Check_prices: https://www.snapeda.com/parts/PCA9685PW,112/NXP%20USA%20Inc./view-part/550390/?ref=eda

## Sheet LED.SchDoc
size A
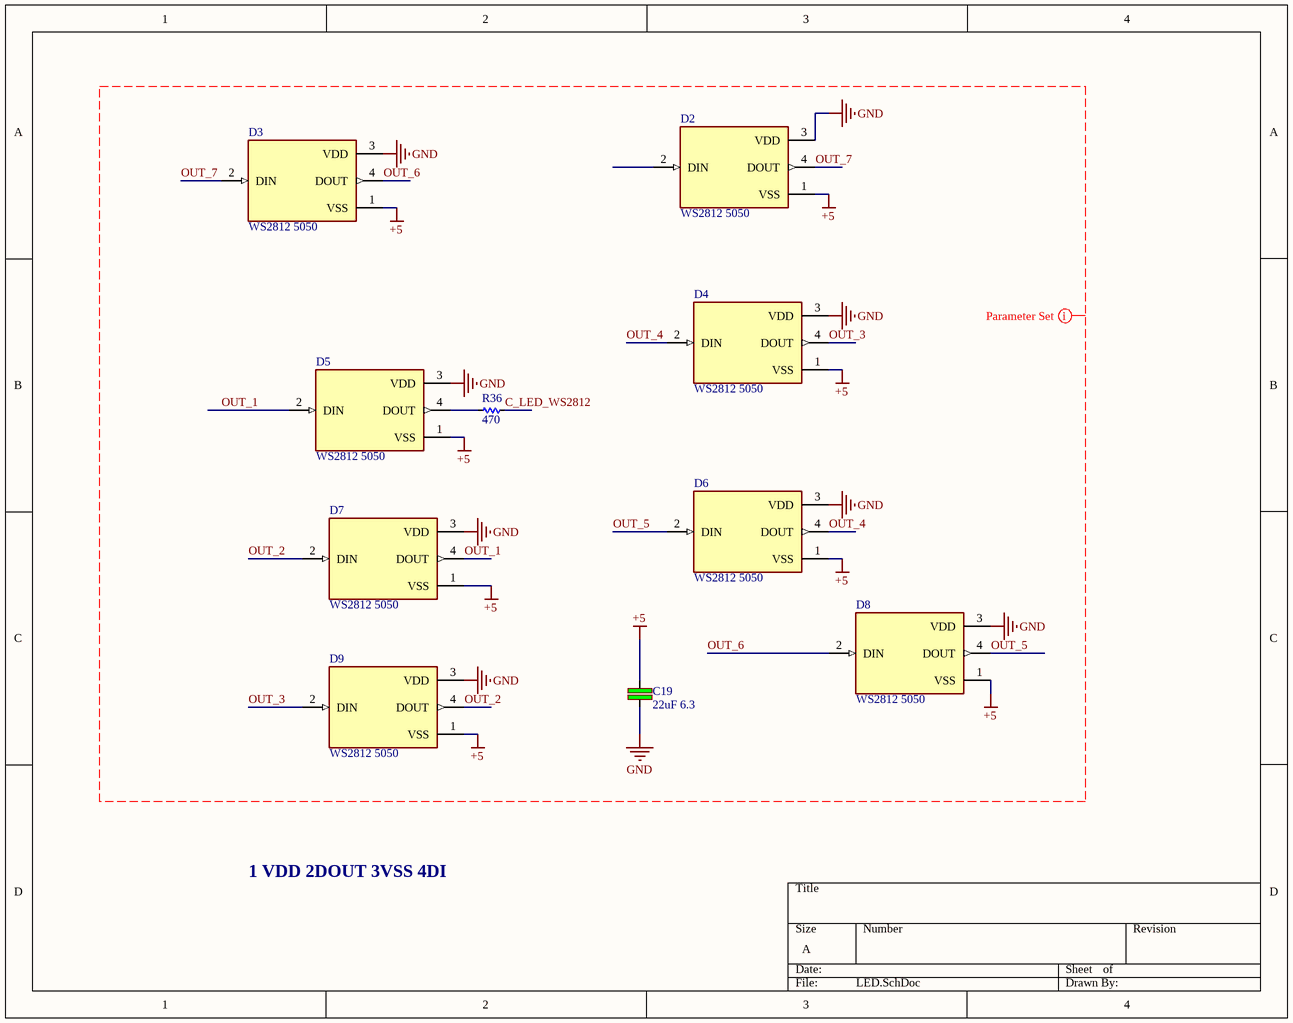
[diagram p4: LED.SchDoc]

### Parts
C19  22uF 6.3  [CN-SMD-1206]
D2  WS2812 5050  [LED_1655]
D3  WS2812 5050  [LED_1655]
D4  WS2812 5050  [LED_1655]
D5  WS2812 5050  [LED_1655]
D6  WS2812 5050  [LED_1655]
D7  WS2812 5050  [LED_1655]
D8  WS2812 5050  [LED_1655]
D9  WS2812 5050  [LED_1655]
R36  470  [RES-SMD-0603]

### Nets
+5: C19.2 D2.1(VSS) D3.1(VSS) D4.1(VSS) D5.1(VSS) D6.1(VSS) D7.1(VSS) D8.1(VSS) D9.1(VSS)
GND: C19.1 D2.3(VDD) D3.3(VDD) D4.3(VDD) D5.3(VDD) D6.3(VDD) D7.3(VDD) D8.3(VDD) D9.3(VDD)
C_LED_WS2812: R36.1
OUT_1: D5.2(DIN) D7.4(DOUT)
OUT_2: D7.2(DIN) D9.4(DOUT)
OUT_3: D4.4(DOUT) D9.2(DIN)
OUT_4: D4.2(DIN) D6.4(DOUT)
OUT_5: D6.2(DIN) D8.4(DOUT)
OUT_6: D3.4(DOUT) D8.2(DIN)
OUT_7: D2.4(DOUT) D3.2(DIN)
NetD5_4: D5.4(DOUT) R36.2

Not connected (* = marked no-connect by the designer): D2 2(DIN)

### Layout directives
net class LED: +5, C_LED_WS2812, GND, OUT_1, OUT_2, OUT_3, OUT_4, OUT_5, OUT_6, OUT_7

### Notes on the sheet
- 1 VDD 2DOUT 3VSS 4DI

### Library data of the parts
C19 = C: Cap SMD 1206 >5V; Value: 103
D2-D9 = 1655: Addressable Lighting Neopixel 10 LED Discrete Serial _Shift Register_ Red, Green, Blue _RGB_ 5.00mm L x 5.00mm W; MF: Adafruit Industries; Value: *; SnapEDA_Link: https://www.snapeda.com/parts/1655/Adafruit%20Industries%20LLC/view-part/53433/?ref=snap; Price: None; Availability: Unavailable; Package: TSOP-38238 Adafruit Industries; MP: 1655
R36 = Res-SMD: as R1#1 on sheet Power; Published: 08/06/2000; Publisher: Altium Hobart Technology Centre

## Nets that join several sheets
+5: Power (5 pins), MCU (U5.16 USB1.1), LED (9 pins)
+5L: Power (C5#1.1 C6#1.1 U2#1.2), MCU (16 pins)
+9: Power (C1#1.2 R4#1.2 U1#1.3), Motor (5 pins)
GND: Power (31 pins), MCU (69 pins), Motor (20 pins), LED (9 pins)
VCC: Power (Cx4.2 R6#1.2 U3#1.2), MCU (24 pins), Motor (9 pins)
ADC_POWER: Power (Cx6.2 IC1.6 IC1.7), MCU (U4.4)
C_LED_WS2812: MCU (U4.8), LED (R36.1)
HAL_CHA_M1: MCU (U4.10), Motor (J3.5)
HAL_CHA_M2: MCU (U4.12), Motor (J4.5)
HAL_CHB_M1: MCU (U4.11), Motor (J3.6)
HAL_CHB_M2: MCU (U4.13), Motor (J4.6)
PWM_A: MCU (U4.9), Motor (U9.23)
PWM_B: MCU (U4.16), Motor (U9.15)
S1: MCU (P11.3), Motor (U10.15)
S2: MCU (P9.3), Motor (U10.16)
S3: MCU (P15.3), Motor (U10.17)
S4: MCU (P16.3), Motor (U10.18)
S5: MCU (P12.3), Motor (U10.19)
S6: MCU (P10.3), Motor (U10.20)
S7: MCU (P13.3), Motor (U10.21)
S8: MCU (P14.3), Motor (U10.22)
SCL: MCU (7 pins), Motor (R35.1 U10.26)
SDA: MCU (7 pins), Motor (R34.1 U10.27)